# Altium schematic sheet 02 ECE453-Digital-Interface.SchDoc
size C; PageSetup: Record=PageOptions|CenterHorizontal=True|CenterVertical=True|PrintScale=0.70|XCorrection=1.00|YCorrection=1.00|PrintKind=1|BorderSize=5000000|LeftOffset=0|BottomOffset=0|Orientation=2|PaperLength=1000|PaperWidth=1000|Scale=100|PaperSource=7|PrintQuality=-3|MediaType=1|DitherType=10|PrintScaleMode=1|PaperKind=Tabloid|PaperIndex=3
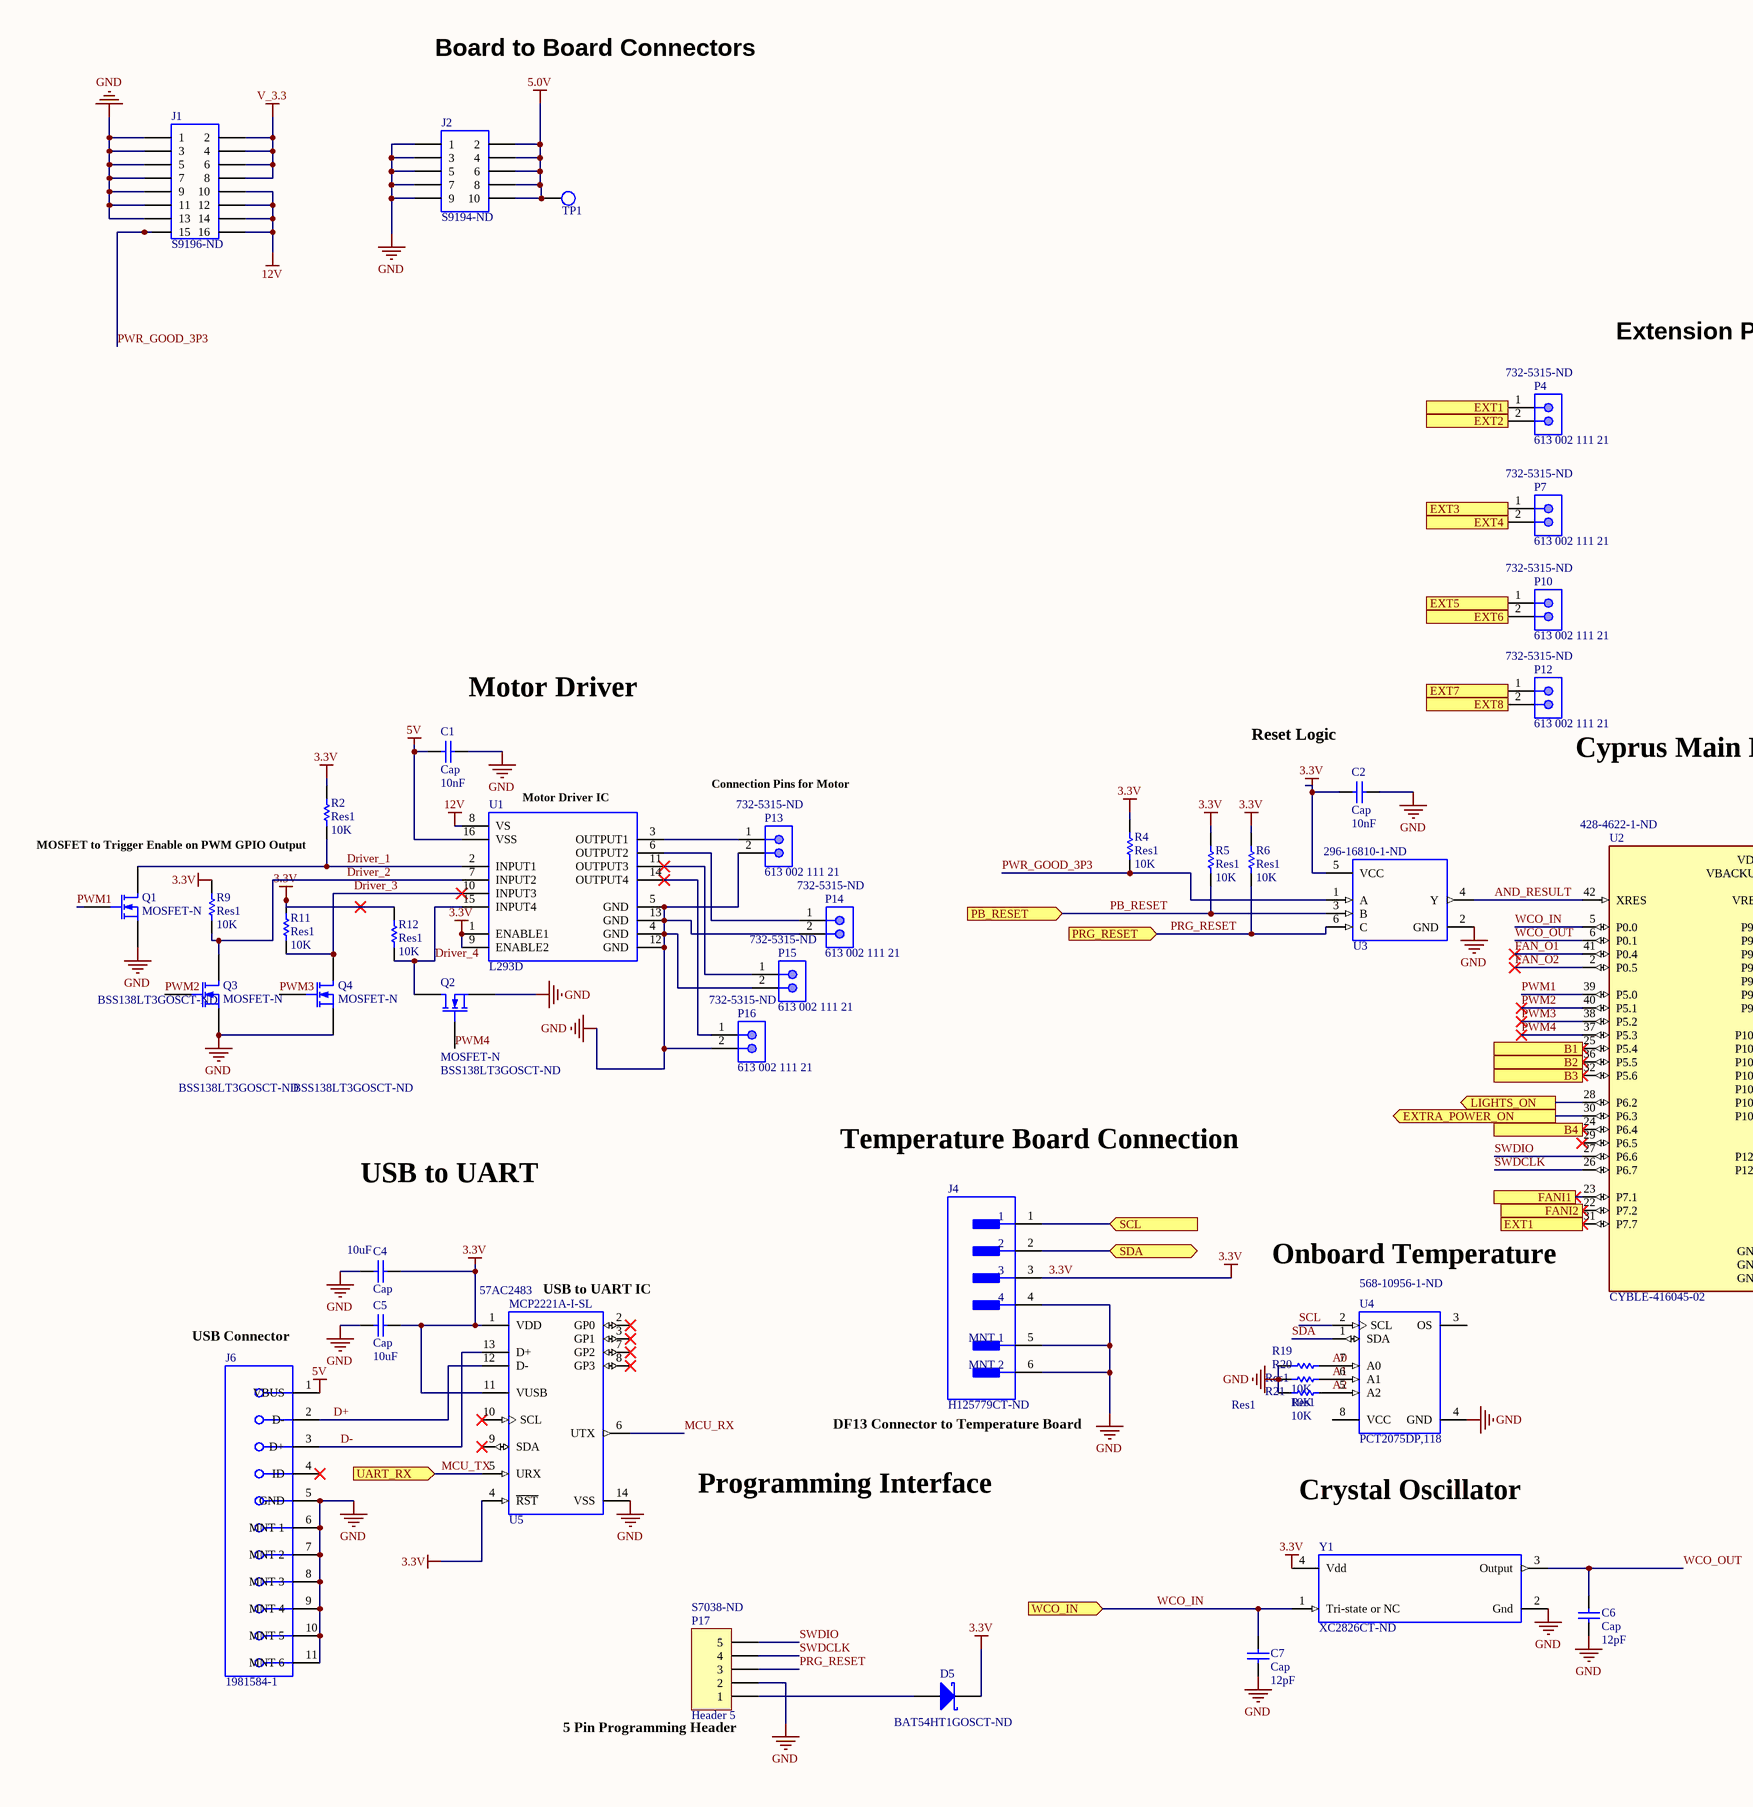
[diagram p0: 02 ECE453-Digital-Interface.SchDoc, left]
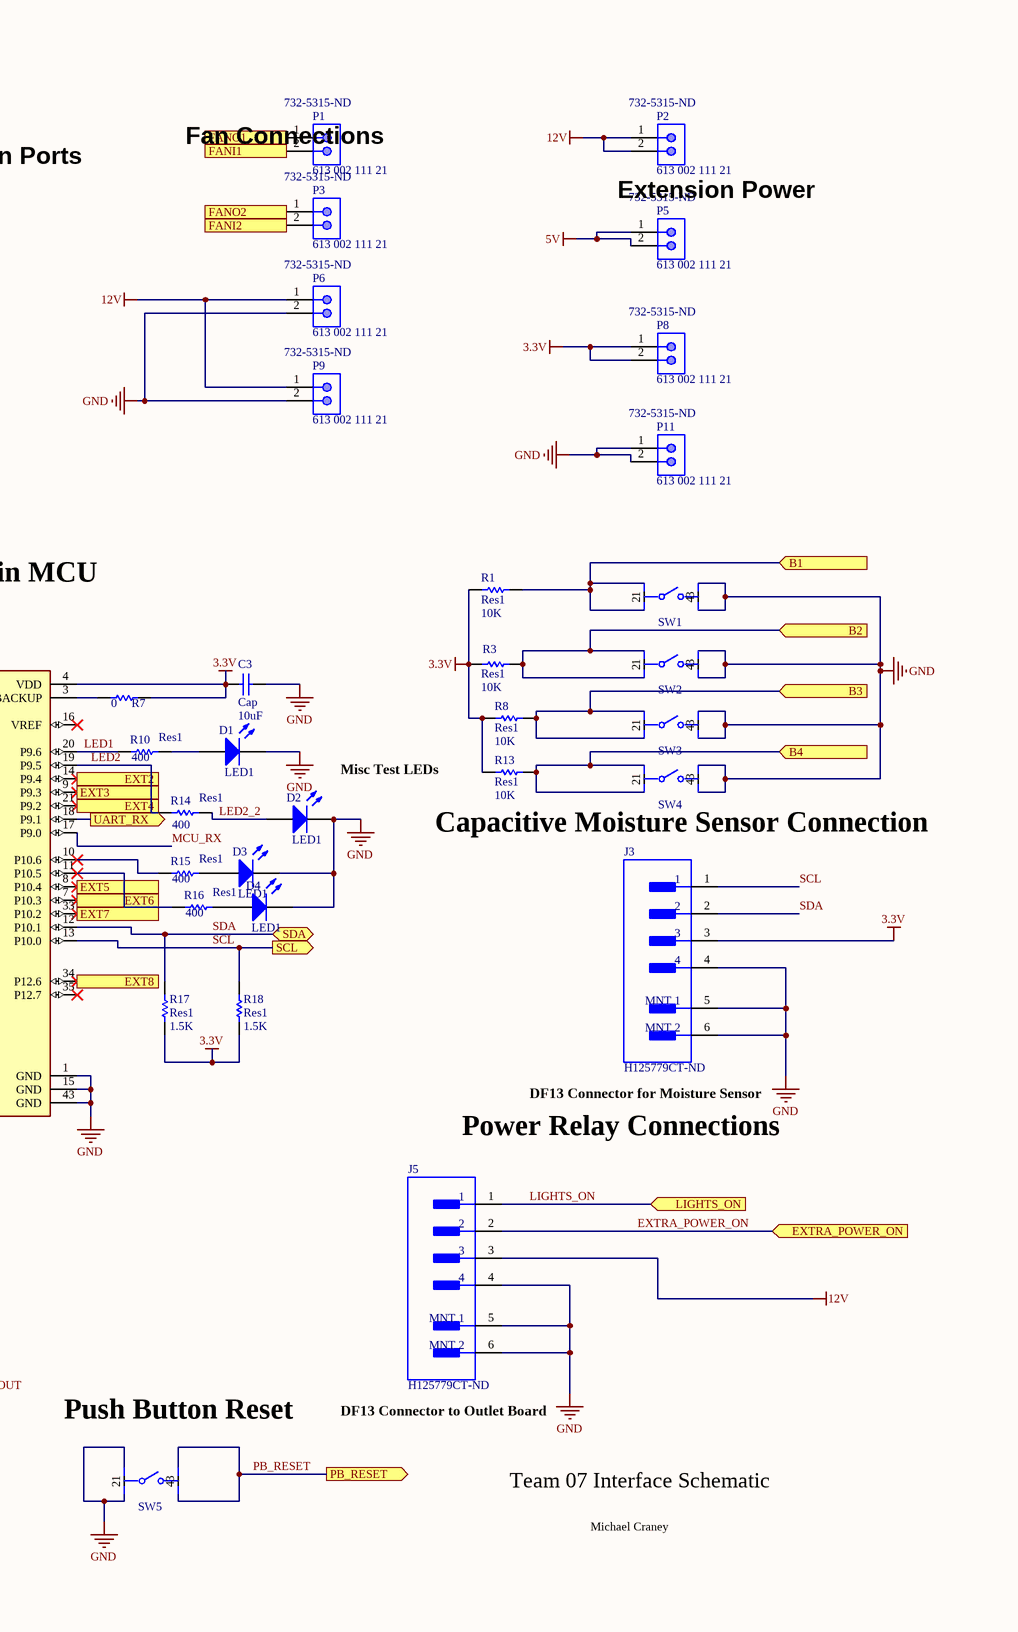
[diagram p1: 02 ECE453-Digital-Interface.SchDoc, right]

## Parts
C1  Cap  value 10nF  [Yageo_CC0805-0.85_IPC_B]
C2  Cap  value 10nF  [Yageo_CC0805-0.85_IPC_B]
C3  Cap  value 10uF  [Yageo_CC0805-0.85_IPC_B]
C4  Cap  value 10uF  [Yageo_CC0805-0.85_IPC_B]
C5  Cap  value 10uF  [Yageo_CC0805-0.85_IPC_B]
C6  Cap  value 12pF  [Yageo_CC0805-0.85_IPC_B]
C7  Cap  value 12pF  [Yageo_CC0805-0.85_IPC_B]
D1  LED1  [Dialight_598_0]
D2  LED1  [Dialight_598_0]
D3  LED1  [Dialight_598_0]
D4  LED1  [Dialight_598_0]
D5  Supplier Part Number 1: BAT54HT1GOSCT-ND  [On_Semiconductor_BAT54HT1G_0]
J1  Supplier Part Number 1: S9196-ND  [SFH11-PBPC-D08-ST-BK]  (hidden comment: SFH11-PBPC-D08-ST-BK)
J2  Supplier Part Number 1: S9194-ND  [SFH11-PBPC-D05-ST-BK]  (hidden comment: SFH11-PBPC-D05-ST-BK)
J3  Supplier Part Number 1: H125779CT-ND  [Hirose_0_MFG]  (hidden comment: DF13A-4P-1_25H_51)
J4  Supplier Part Number 1: H125779CT-ND  [Hirose_0_MFG]  (hidden comment: DF13A-4P-1_25H_51)
J5  Supplier Part Number 1: H125779CT-ND  [Hirose_0_MFG]  (hidden comment: DF13A-4P-1_25H_51)
J6  Part Number: 1981584-1  [TE_CONNECTIVITY_-_AMP_CONNECTORS_1981584-1_0]  (hidden comment: Conn_TE_CONNECTIVITY_-_AMP_CONNECTORS_1981584-1_eec)
P1  613 002 111 21  Supplier Part Number 1: 732-5315-ND  [WE-61300211121_V]
P2  613 002 111 21  Supplier Part Number 1: 732-5315-ND  [WE-61300211121_V]
P3  613 002 111 21  Supplier Part Number 1: 732-5315-ND  [WE-61300211121_V]
P4  613 002 111 21  Supplier Part Number 1: 732-5315-ND  [WE-61300211121_V]
P5  613 002 111 21  Supplier Part Number 1: 732-5315-ND  [WE-61300211121_V]
P6  613 002 111 21  Supplier Part Number 1: 732-5315-ND  [WE-61300211121_V]
P7  613 002 111 21  Supplier Part Number 1: 732-5315-ND  [WE-61300211121_V]
P8  613 002 111 21  Supplier Part Number 1: 732-5315-ND  [WE-61300211121_V]
P9  613 002 111 21  Supplier Part Number 1: 732-5315-ND  [WE-61300211121_V]
P10  613 002 111 21  Supplier Part Number 1: 732-5315-ND  [WE-61300211121_V]
P11  613 002 111 21  Supplier Part Number 1: 732-5315-ND  [WE-61300211121_V]
P12  613 002 111 21  Supplier Part Number 1: 732-5315-ND  [WE-61300211121_V]
P13  613 002 111 21  Supplier Part Number 1: 732-5315-ND  [WE-61300211121_V]
P14  613 002 111 21  Supplier Part Number 1: 732-5315-ND  [WE-61300211121_V]
P15  613 002 111 21  Supplier Part Number 1: 732-5315-ND  [WE-61300211121_V]
P16  613 002 111 21  Supplier Part Number 1: 732-5315-ND  [WE-61300211121_V]
P17  Header 5  Supplier Part Number 1: S7038-ND  [HDR1X5]
Q1  MOSFET-N  Supplier Part Number 1: BSS138LT3GOSCT-ND  [On_Semiconductor_318-08_IPC_B]
Q2  MOSFET-N  Supplier Part Number 1: BSS138LT3GOSCT-ND  [On_Semiconductor_318-08_IPC_B]
Q3  MOSFET-N  Supplier Part Number 1: BSS138LT3GOSCT-ND  [On_Semiconductor_318-08_IPC_B]
Q4  MOSFET-N  Supplier Part Number 1: BSS138LT3GOSCT-ND  [On_Semiconductor_318-08_IPC_B]
R1  Res1  value 10K  [RESC2013X70X40NL20T20]
R2  Res1  value 10K  [RESC2013X70X40NL20T20]
R3  Res1  value 10K  [RESC2013X70X40NL20T20]
R4  Res1  value 10K  [RESC2013X70X40NL20T20]
R5  Res1  value 10K  [RESC2013X70X40NL20T20]
R6  Res1  value 10K  [RESC2013X70X40NL20T20]
R7  0  [RESC2013X70X40NL20T20]
R8  Res1  value 10K  [RESC2013X70X40NL20T20]
R9  Res1  value 10K  [RESC2013X70X40NL20T20]
R10  Res1  value 400  [RESC2013X70X40NL20T20]
R11  Res1  value 10K  [RESC2013X70X40NL20T20]
R12  Res1  value 10K  [RESC2013X70X40NL20T20]
R13  Res1  value 10K  [RESC2013X70X40NL20T20]
R14  Res1  value 400  [RESC2013X70X40NL20T20]
R15  Res1  value 400  [RESC2013X70X40NL20T20]
R16  Res1  value 400  [RESC2013X70X40NL20T20]
R17  Res1  value 1.5K  [RESC2013X70X40NL20T20]
R18  Res1  value 1.5K  [RESC2013X70X40NL20T20]
R19  Res1  value 10K  [RESC2013X70X40NL20T20]
R20  Res1  value 10K  [RESC2013X70X40NL20T20]
R21  Res1  value 10K  [RESC2013X70X40NL20T20]
SW1  Switch_TE_FSM2JSMAATR_eec  [TE_FSM2JSMAATR_0]  (value not drawn)
SW2  Switch_TE_FSM2JSMAATR_eec  [TE_FSM2JSMAATR_0]  (value not drawn)
SW3  Switch_TE_FSM2JSMAATR_eec  [TE_FSM2JSMAATR_0]  (value not drawn)
SW4  Switch_TE_FSM2JSMAATR_eec  [TE_FSM2JSMAATR_0]  (value not drawn)
SW5  Switch_TE_FSM2JSMAATR_eec  [TE_FSM2JSMAATR_0]  (value not drawn)
TP1  TP_1206  [TP-SMC-1206]  (value not drawn)
U1  Part Number: L293D  [STMicroelectronics_L293D_0]  (hidden comment: IC_STMicroelectronics_L293D_eec)
U2  CYBLE-416045-02  Supplier Part Number 1: 428-4622-1-ND  [Cypress_Semiconductor_0_MFG]
U3  Supplier Part Number 1: 296-16810-1-ND  [Texas_Instruments_DBV0006A_0]  (hidden comment: SN74LVC1G11DBVR)
U4  PCT2075DP,118  Supplier Part Number 1: 568-10956-1-ND  [NXP-SOT505-1_N]
U5  MCP2221A-I-SL  Supplier Part Number 1: 57AC2483  [Microchip_C04-065-SL_IPC_B - duplicate]
Y1  Supplier Part Number 1: XC2826CT-ND  [ECS_327ATQMV_MFG]  (hidden comment: ECS-327ATQMV-AS-TR)

## Ports
B1 (in), B2 (in), B3 (in), B4 (in), EXT1, EXT2, EXT3, EXT4, EXT5, EXT6, EXT7, EXT8, EXTRA_POWER_ON (in), EXTRA_POWER_ON (out), FANI1, FANI2, FANO1, FANO2, LIGHTS_ON (in), LIGHTS_ON (out), PB_RESET (in), PB_RESET (out), PRG_RESET (in), SCL (in), SCL (out), SDA (bidir), UART_RX (in), UART_RX (out), WCO_IN (in)

## Nets
3.3V: C2.2 C3.2 C4.1 C5.1 D5.2(K) J3.3 J4.3 P8.1 P8.2 R1.2 R2.2 R3.2 R4.2 R5.2 R6.2 R7.1 R8.2 R9.1 R11.1 R12.1 R13.2 R17.1 R18.1 U1.1(ENABLE1) U1.9(ENABLE2) U2.4(VDD) U3.5(VCC) U5.1(VDD) U5.4(~{RST}) U5.11(VUSB) Y1.4(Vdd)
5.0V: J2.2 J2.4 J2.6 J2.8 J2.10 TP1.1
5V: C1.2 J6.1(VBUS) P5.1 P5.2 U1.16(VSS)
12V: J1.10 J1.12 J1.14 J1.16 J5.3 P2.1 P2.2 P6.1 P9.1 U1.8(VS)
GND: C1.1 C2.1 C3.1 C4.2 C5.2 C6.1 C7.1 D1.2(K) D2.2(K) D3.2(K) D4.2(K) J1.1 J1.3 J1.5 J1.7 J1.9 J1.11 J1.13 J2.1 J2.3 J2.5 J2.7 J2.9 J3.4 J3.5(MNT_1) J3.6(MNT_2) J4.4 J4.5(MNT_1) J4.6(MNT_2) J5.4 J5.5(MNT_1) J5.6(MNT_2) J6.5(GND) J6.6(MNT_1) J6.7(MNT_2) J6.8(MNT_3) J6.9(MNT_4) J6.10(MNT_5) J6.11(MNT_6) P6.2 P9.2 P11.1 P11.2 P13.2 P14.2 P15.2 P16.2 P17.2 Q1.3(S) Q2.3(S) Q3.3(S) Q4.3(S) R19.2 R20.2 R21.2 SW1.3 SW1.4 SW2.3 SW2.4 SW3.3 SW3.4 SW4.3 SW4.4 SW5.1 SW5.2 U1.4(GND) U1.5(GND) U1.12(GND) U1.13(GND) U2.1(GND) U2.15(GND) U2.43(GND) U3.2(GND) U4.4(GND) U5.14(VSS) Y1.2(Gnd)
V_3.3: J1.2 J1.4 J1.6 J1.8
A0: R19.1 U4.7(A0)
A1: R20.1 U4.6(A1)
A2: R21.1 U4.5(A2)
AND_RESULT: U2.42(XRES) U3.4(Y)
B1: R1.1 SW1.1 SW1.2 U2.25(P5.4) ; port B1
B2: R3.1 SW2.1 SW2.2 U2.36(P5.5) ; port B2
B3: R8.1 SW3.1 SW3.2 U2.32(P5.6) ; port B3
B4: R13.1 SW4.1 SW4.2 U2.24(P6.4) ; port B4
D+: J6.2(D-) U5.12(D-)
D-: J6.3(D+) U5.13(D+)
Driver_1: Q1.1(D) R2.1 U1.2(INPUT1)
Driver_2: Q3.1(D) R9.2 U1.7(INPUT2)
Driver_3: Q4.1(D) R11.2 U1.10(INPUT3)
Driver_4: Q2.1(D) R12.2 U1.15(INPUT4)
EXT1: P4.1 U2.31(P7.7) ; port EXT1
EXT2: P4.2 U2.14(P9.4) ; port EXT2
EXT3: P7.1 U2.9(P9.3) ; port EXT3
EXT4: P7.2 U2.21(P9.2) ; port EXT4
EXT5: P10.1 U2.8(P10.4) ; port EXT5
EXT6: P10.2 U2.7(P10.3) ; port EXT6
EXT7: P12.1 U2.33(P10.2) ; port EXT7
EXT8: P12.2 U2.34(P12.6) ; port EXT8
EXTRA_POWER_ON: J5.2 U2.30(P6.3) ; port EXTRA_POWER_ON
FAN_O1: U2.41(P0.4)
FAN_O2: U2.2(P0.5)
FANI1: P1.2 U2.23(P7.1) ; port FANI1
FANI2: P3.2 U2.22(P7.2) ; port FANI2
FANO1: P1.1 ; port FANO1
FANO2: P3.1 ; port FANO2
LED1: R10.1 U2.20(P9.6)
LED2: R14.1 U2.19(P9.5)
LED2_2: D2.1(A) R14.2
LIGHTS_ON: J5.1 U2.28(P6.2) ; port LIGHTS_ON
MCU_RX: U2.17(P9.0) U5.6(UTX)
MCU_TX: U2.18(P9.1) U5.5(URX) ; port UART_RX
PB_RESET: R5.1 SW5.3 SW5.4 U3.3(B) ; port PB_RESET
PRG_RESET: P17.3 R6.1 U3.6(C) ; port PRG_RESET
PWM1: Q1.2(G) U2.39(P5.0)
PWM2: Q3.2(G) U2.40(P5.1)
PWM3: Q4.2(G) U2.38(P5.2)
PWM4: Q2.2(G) U2.37(P5.3)
PWR_GOOD_3P3: J1.15 R4.1 U3.1(A)
SCL: J3.1 J4.1 R18.2 U2.13(P10.0) U4.2(SCL) ; port SCL
SDA: J3.2 J4.2 R17.2 U2.12(P10.1) U4.1(SDA) ; port SDA
SWDCLK: P17.4 U2.26(P6.7)
SWDIO: P17.5 U2.27(P6.6)
WCO_IN: C7.2 U2.5(P0.0) Y1.1(Tri-state_or_NC) ; port WCO_IN
WCO_OUT: C6.2 U2.6(P0.1) Y1.3(Output)
NetD1_1: D1.1(A) R10.2
NetD3_1: D3.1(A) R15.2
NetD4_1: D4.1(A) R16.2
NetD5_1: D5.1(A) P17.1
NetP13_1: P13.1 U1.3(OUTPUT1)
NetP14_1: P14.1 U1.6(OUTPUT2)
NetP15_1: P15.1 U1.11(OUTPUT3)
NetP16_1: P16.1 U1.14(OUTPUT4)
NetR7_2: R7.2 U2.3(VBACKUP)
NetR15_1: R15.1 U2.10(P10.6)
NetR16_1: R16.1 U2.11(P10.5)

Not connected (* = marked no-connect by the designer): J6 4(ID)*; U2 16(VREF)* 29(P6.5)* 35(P12.7)*; U4 3(OS) 8(VCC); U5 2(GP0)* 3(GP1)* 7(GP2)* 8(GP3)* 9(SDA)* 10(SCL)*

## Notes on the sheet
- Board to Board Connectors
- Extension Ports
- Fan Connections
- Extension Power
- (near C1) Motor Driver
- (near P13) Connection Pins for Motor
- (near C2) Reset Logic
- (near P12) Cyprus Main MCU
- MOSFET to Trigger Enable on PWM GPIO Output
- (near U1) Motor Driver IC
- Misc Test LEDs
- (near SW4) Capacitive Moisture Sensor Connection
- USB to UART
- Temperature Board Connection
- (near U5) USB to UART IC
- Onboard Temperature
- Power Relay Connections
- (near J3) DF13 Connector for Moisture Sensor
- (near J6) USB Connector
- (near J4) DF13 Connector to Temperature Board
- Programming Interface
- Crystal Oscillator
- (near SW5) Push Button Reset
- (near J5) DF13 Connector to Outlet Board
- Team 07 Interface Schematic
- (near P17) 5 Pin Programming Header
- Michael Craney

## Library data of the parts
C1-C7 = Cap: Capacitor; Published: 8-Jun-2000; LatestRevisionDate: 17-Jul-2002; LatestRevisionNote: Re-released for DXP Platform.; PackageReference: RAD-0.3; Publisher: Altium Limited; PackageDescription: Radial Cap, Thru-Hole; 2 Leads; 0.3 in Pin Spacing; Supplier 1: Digi-Key
  C1 C2: Supplier Part Number 1: 311-1136-1-ND
  C3-C5: Supplier Part Number 1: 311-1355-1-ND
  C6 C7: Supplier Part Number 1: 311-1100-1-ND
D1-D4 = LED1: Typical RED GaAs LED; Published: 8-Jun-2000; LatestRevisionDate: 08-Jul-2005; LatestRevisionNote: Mech Layer 1 removed.; PackageReference: LED-1; Publisher: Altium Limited; PackageDescription: LED; 2 Leads; Supplier 1: Digi-Key; Supplier Part Number 1: 350-2038-1-ND
D5 = D Schottky: Schottky Diode; Published: 8-Jun-2000; LatestRevisionDate: 17-Jul-2002; LatestRevisionNote: Re-released for DXP Platform.; PackageReference: SMB; Publisher: Altium Limited; PackageDescription: DO-214-AA/SMB; 2 C-Bend Leads; Body 5.3 x 3.6 mm, inc. leads (LxW); Code_JEDEC: DO-214-AA; Supplier 1: Digi-Key
J1 = SFH11-PBPC-D08-ST-BK: CONN HDR 10POS 0.1 GOLD PCB; Manufacturer 1: Sullins; Number of Positions: 16; Connector Type: Header,Socket; Pitch: 0.1inch; ComponentLink1URL: https://datasheet.ciiva.com/754/sfh11-pxxc-dxx-st-xx11160-c-754555.pdf?src-supplier=Digi-Key; ComponentLink1Description: https://datasheet.ciiva.com/754/sfh11-pxxc-dxx-st-xx11160-c-754555.pdf?src-supplier=Digi-Key; Supplier 1: Digi-Key; Manufacturer Part Number 1: SFH11-PBPC-D08-ST-BK; Stock 1: 0; Pricing 1: 1=1.04000, 10=0.91600, 100=0.79000, 500=0.64638, 1000=0.57456, 5000=0.51870 (USD); RoHS: Yes; Mount: Through Hole; Color: Black; Contact Plating: Gold; Package Quantity: 1; Number of Rows: 2; Packaging: Tray; Termination: Solder; Row Spacing: 0.1inch; Lead Free: Lead Free; ComponentLink2URL: https://datasheet.ciiva.com/754/sfh11-pxxc-dxx-st-xx11160-c-754557.pdf?src-supplier=Digi-Key; ComponentLink2Description: https://datasheet.ciiva.com/754/sfh11-pxxc-dxx-st-xx11160-c-754557.pdf?src-supplier=Digi-Key
J2 = SFH11-PBPC-D05-ST-BK: CONN HDR 10POS 0.1 GOLD PCB; Manufacturer 1: Sullins; Number of Positions: 10; Connector Type: Header; Pitch: 0.1inch; Supplier 1: Digi-Key; Manufacturer Part Number 1: SFH11-PBPC-D05-ST-BK; Stock 1: 26289; Pricing 1: 1=0.66000, 10=0.57600, 100=0.49700, 500=0.40662, 1000=0.36144, 5000=0.32630 (USD); RoHS: Yes; Mount: Through Hole; Color: Black; Contact Plating: Gold; Package Quantity: 1; Number of Rows: 2; Packaging: Tray; Termination: Solder; Row Spacing: 0.1inch; Lead Free: Lead Free; ComponentLink1URL: https://datasheet.ciiva.com/754/sfh11-pxxc-dxx-st-xx11160-c-754555.pdf?src-supplier=Digi-Key; ComponentLink1Description: https://datasheet.ciiva.com/754/sfh11-pxxc-dxx-st-xx11160-c-754555.pdf?src-supplier=Digi-Key
J3-J5 = DF13A-4P-1_25H_51: 4 pin df13; Supplier 1: Digi-Key
J6 = Conn_TE_CONNECTIVITY_-_AMP_CONNECTORS_1981584-1_eec: Micro USB2.0; Manufacturer: TE CONNECTIVITY - AMP CONNECTORS; Voltage: 30V; Is Female: yes; helpURL: https://upverter.com/upn/revision/dedb0eacb1b6d15a/; ComponentLink2Description: Datasheet; Temperature: to; Package: CONN_USB_SMT; Supplier 2: Mouser; Price: 1.40015774577; Supplier 1: Digi-Key; ComponentLink1URL: https://upverter.com/upn/revision/dedb0eacb1b6d15a/; Supplier Part Number 1: A97799CT-ND; ComponentLink1Description: Upverter; ComponentLink2URL: http://www.te.com/commerce/DocumentDelivery/DDEController?Action=srchrtrv&DocNm=1981584&DocType=Customer+Drawing&DocLang=English; RoHS: UNKNOWN; Mouser Part Number: 571-1981584-1; Operating Temperature Low: -30°C; Digikey Part Number:: A97799CT-ND; Operating Temperature High: 85°C
P1-P16 = 61300211121: Male Header, Pitch 2.54 mm, 1 x 2 Position, Height 8.54 mm, Tail Length 3 mm, -40 to 105 degC, RoHS, Bulk; ComponentLink1Description: Manufacturer URL; ComponentLink2Description: Datasheet; DatasheetVersion: Rev. J; ComponentLink1URL: https://www.we-online.com/; ComponentLink2URL: http://katalog.we-online.de/em/datasheet/6130xx11121.pdf; Mounting Technology: Through Hole; PackageDescription: Male Header, Pitch 2.54 mm, 1 x 2 Position, Height 8.54 mm, Tail Length 3 mm; PartNumber: 613 002 111 21; Supplier 1: Digi-Key
P17 = Header 5: CONN HDR 5POS 0.1 GOLD PCB; Manufacturer: Sullins; Manufacturer Part Number: PPPC051LFBN-RC; Number of Positions: 5; Pitch: 0.1inch; LatestRevisionDate: 17-Jul-2002; LatestRevisionNote: Re-released for DXP Platform.; Publisher: Altium Limited; Supplier 1: Digi-Key; RoHS: Yes; Category: Connectors; Stock 1: 10661; Pricing 1: 1=0.49000, 10=0.45900, 100=0.35190, 500=0.30600, 1000=0.25245, 5000=0.22185, 10000=0.22100 (USD); Mount: Through Hole; Color: Black; Contact Plating: Gold; Contact Material: Bronze; Housing Material: Plastic; Package Quantity: 1000; Number of Rows: 1; Packaging: Bulk; Termination: Solder; Connector Type: Header; Contact Type: Female Socket; Length: 13.2mm; Width: 2.5mm; Height: 8.5mm; Lead Free: Lead Free; RoHS Compliant: Yes; ComponentLink1URL: https://media.digikey.com/pdf/Data%20Sheets/Sullins%20PDFs/Female_Headers.100_DS.pdf?src-supplier=Digi-Key; ComponentLink1Description: https://media.digikey.com/pdf/Data%20Sheets/Sullins%20PDFs/Female_Headers.100_DS.pdf?src-supplier=Digi-Key; ComponentLink2URL: http://www.sullinscorp.com/catalogs/78_Page80-81_HEADER_.100_2.54mm_FEMALE.pdf?src-supplier=Future+Electronics; ComponentLink2Description: http://www.sullinscorp.com/catalogs/78_Page80-81_HEADER_.100_2.54mm_FEMALE.pdf?src-supplier=Future+Electronics
Q1-Q4 = MOSFET-N: N-Channel MOSFET; Published: 8-Jun-2000; LatestRevisionDate: 17-Jul-2002; LatestRevisionNote: Re-released for DXP Platform.; PackageVersion: 1995/1996; PackageReference: E3; Publisher: Altium Limited; PackageDescription: TO, Flat Index; 3 In-Line, Axial Leads; Body Dia. 4.6mm; Lead Dia. 0.5 mm (max); Supplier 1: Digi-Key
R1-R21 = Res1: Resistor; Published: 8-Jun-2000; LatestRevisionDate: 17-Jul-2002; LatestRevisionNote: Re-released for DXP Platform.; PackageReference: AXIAL-0.3; Publisher: Altium Limited; PackageDescription: Axial Device, Thru-Hole; 2 Leads; 0.3 in Pin Spacing; Supplier 1: Digi-Key
  R1-R6 R8 R9 R11-R13 R19-R21: Supplier Part Number 1: P10.0KCCT-ND
  R7: Supplier Part Number 1: P0.0ACT-ND
  R10 R14-R16: Supplier Part Number 1: 541-430CCT-ND
  R17 R18: Supplier Part Number 1: 2019-RK73B2ATTD152JCT-ND
SW1-SW5 = Switch_TE_FSM2JSMAATR_eec: SWITCH TACTILE SPST-NO 0.05A 24V; Manufacturer: TE; Part Number: FSM2JSMAATR; helpURL: https://upverter.com/upn/revision/e87fdb98fc0d886d/; ComponentLink2Description: Datasheet; Temperature: -35°C to +85°C; Package: SW_SMT_TACT; Supplier 2: Mouser; Supplier 1: Digi-Key; ComponentLink1URL: https://upverter.com/upn/revision/e87fdb98fc0d886d/; Supplier Part Number 2: 506-FSM2JSMAATR; Supplier Part Number 1: 450-1792-1-ND; ComponentLink1Description: Upverter; ComponentLink2URL: http://www.te.com/commerce/DocumentDelivery/DDEController?Action=srchrtrv&DocNm=2-1437565-7&DocType=Customer+Drawing&DocLang=English; RoHS: TRUE; Mouser Part Number: 506-FSM2JSMAATR; Digikey Description: SWITCH TACTILE SPST-NO 0.05A 24V; Digikey Part Number: 450-1792-1-ND; Lead Free: yes; Temperature Range Low: -35°C; Temperature Range High: +85°C
TP1 = TP_1206: Test Point SMD 1206; Supplier 1: Digi-Key; Supplier Part Number 1: A106143CT-ND
U1 = IC_STMicroelectronics_L293D_eec: 4-Channel Motor Driver 24V 16-Pin Power DIP Tube; Category 9E07530Daf1645C0: Semiconductors and Actives; Category 45Fa88F0772B9E3D: Half Bridges; Category 20B3Edb914A9Fb74: Uncategorized; Category 2Fc5E2Cf1B85F402: Interface ICs; Category 56439B4967F48D84: Power Management; Category D2Bc1Fb6E06F097B: Solid State Switches; Symbol 0 0: Standard; Num Pins: 16; Max Supply Voltage: 36V; Min Supply Voltage: 4.5V; Number of Outputs: 4; Output Current: 600mA; Max Output Current: 1.2A; Motor Type: Brushed; Operating Supply Current: 2mA; Power Dissipation: 4W; helpURL: https://upverter.com/upn/revision/e6134e389598ca22/; ComponentLink2Description: Datasheet; Temperature: -40°C to +150°C; Package: Powerdip (12+2+2); Supplier 2: Mouser; Price: 2.80087938713; Supplier 1: Digi-Key; ComponentLink1URL: https://upverter.com/upn/revision/e6134e389598ca22/; Supplier Part Number 2: 511-L293D; Supplier Part Number 1: 497-2936-5-ND; Manufacturer: STMicroelectronics; ComponentLink1Description: Upverter; ComponentLink2URL: https://upverter.com/datasheet/69b4bfb6eef435fc169310577e03cbf66990c4fa.pdf; RoHS: TRUE; Mouser Part Number: 511-L293D; Ipc Land Pattern Name: DIP880W50P254L2000H510Q16; Category 84F649Fcb0Ed5F31: Uncategorized; Octopart Part Number: 81d548d881985e12; Temperature Range High: +150°C; Digikey Description: IC Bipolar Motor Driver Parallel 16-PowerDIP; Digikey Part Number: 497-2936-5-ND; Type: integrated circuit; Lead Free: yes; Temperature Range Low: -40°C; Mounting Type: Through Hole; Manufacturer Part Number: L293D; Category: Motor Drivers; Stock 1: 710; Pricing 1: 1=4.15000, 10=3.72300, 25=3.52000, 100=2.95180 (USD); Mount: Through Hole; Case/Package: DIP; Number of Pins: 16; Min Operating Temperature: -40°C; Max Operating Temperature: 150°C; Package Quantity: 25; Packaging: Rail/Tube; Operating Supply Voltage: 24V; Series: -; Output Current per Channel: 600mA; Number of Channels: 4; Max Collector Current: 600mA; Collector Emitter Voltage (VCEO): 36V; Length: 20mm; Width: 7.1mm; Height: 5.1mm; Radiation Hardening: No; RoHS Compliant: Yes; ComponentLink3URL: https://datasheet.ciiva.com/15109/getdatasheetpartid-121660-15109379.pdf?src-supplier=Verical; ComponentLink3Description: https://datasheet.ciiva.com/15109/getdatasheetpartid-121660-15109379.pdf?src-supplier=Verical; ComponentLink4URL: https://datasheet.ciiva.com/14150/ocl293d-647107-dat-en-14150297.pdf?src-supplier=Distrelec; ComponentLink4Description: https://datasheet.ciiva.com/14150/ocl293d-647107-dat-en-14150297.pdf?src-supplier=Distrelec; ComponentLink5URL: https://datasheet.ciiva.com/26347/82-0192-26347871.pdf?src-supplier=Rapid+Electronics; ComponentLink5Description: https://datasheet.ciiva.com/26347/82-0192-26347871.pdf?src-supplier=Rapid+Electronics; ComponentLink6URL: https://datasheet.ciiva.com/29307/156134-da-01-en-4-kanal-treiber-ic-l293d-stm-29307000.pdf?src-supplier=Conrad; ComponentLink6Description: https://datasheet.ciiva.com/29307/156134-da-01-en-4-kanal-treiber-ic-l293d-stm-29307000.pdf?src-supplier=Conrad; ComponentLink7URL: https://datasheet.ciiva.com/1955/cd00000059-1955400.pdf?src-supplier=Digi-Key; ComponentLink7Description: https://datasheet.ciiva.com/1955/cd00000059-1955400.pdf?src-supplier=Digi-Key; ComponentLink8URL: https://datasheet.ciiva.com/4895/cd00000059-4895945.pdf?src-supplier=Mouser; ComponentLink8Description: https://datasheet.ciiva.com/4895/cd00000059-4895945.pdf?src-supplier=Mouser; ComponentLink9URL: https://datasheet.ciiva.com/16458/cd00000059-16458220.pdf?src-supplier=Future+Electronics; ComponentLink9Description: https://datasheet.ciiva.com/16458/cd00000059-16458220.pdf?src-supplier=Future+Electronics
U2 = CYBLE-416045-02: CONN HDR 5POS 0.1 GOLD PCB; Manufacturer: Sullins; Manufacturer Part Number: PPPC051LFBN-RC; MF: {'manufacturer': u'Cypress Semiconductor'}; Number of Positions: 5; Connector Type: Header; Pitch: 0.1inch; Value: *; Package: None; MP: CYBLE-416045-02; Price: None; Availability: Unavailable; RoHS: Yes; Category: Connectors; Stock 1: 10661; Pricing 1: 1=0.49000, 10=0.45900, 100=0.35190, 500=0.30600, 1000=0.25245, 5000=0.22185, 10000=0.22100 (USD); Mount: Through Hole; Color: Black; Contact Plating: Gold; Contact Material: Bronze; Housing Material: Plastic; Package Quantity: 1000; Number of Rows: 1; Packaging: Bulk; Termination: Solder; Contact Type: Female Socket; Length: 13.2mm; Width: 2.5mm; Height: 8.5mm; Lead Free: Lead Free; RoHS Compliant: Yes; ComponentLink1URL: https://media.digikey.com/pdf/Data%20Sheets/Sullins%20PDFs/Female_Headers.100_DS.pdf?src-supplier=Digi-Key; ComponentLink1Description: https://media.digikey.com/pdf/Data%20Sheets/Sullins%20PDFs/Female_Headers.100_DS.pdf?src-supplier=Digi-Key; ComponentLink2URL: http://www.sullinscorp.com/catalogs/78_Page80-81_HEADER_.100_2.54mm_FEMALE.pdf?src-supplier=Future+Electronics; ComponentLink2Description: http://www.sullinscorp.com/catalogs/78_Page80-81_HEADER_.100_2.54mm_FEMALE.pdf?src-supplier=Future+Electronics; Supplier 1: Digi-Key
U3 = SN74LVC1G11DBVR: 3 to 1 AND Gate; Supplier 1: Digi-Key
U4 = PCT2075DP,118: I2C-Bus Fm+, 1 Degree C Accuracy, Digital Temperature Sensor and Thermal Watchdog, 2.7 to 5.5 V Supply, -55 to 125 degC, 8-Pin SOT505-1, RoHS, Reel; Manufacturer: NXP Semiconductors; Accuracy on-chip (degC): 1@-25 to 100 / 2@-55 to 125; SMBus clock (kHz): 1000; Assignable addresses: 27; ComponentLink1Description: Manufacturer URL; Operating Voltage (VDC): 2.7 to 5.5; ComponentLink2Description: Datasheet; PartNumber: PCT2075DP,118; ComponentLink3Description: Package Specification; PackageReference: SOT505-1; ComponentLink3URL: http://www.nxp.com/documents/outline_drawing/sot505-1_po.pdf; DatasheetVersion: Rev. 7; ComponentLink1URL: http://www.nxp.com/; ComponentLink2URL: http://www.nxp.com/documents/data_sheet/PCT2075.pdf; Packing: Reel; Mounting Technology: Surface Mount; PackageDescription: 8-Pin Plastic Thin Shrink Small Outline Package, Body 3 x 3 mm, Pitch 0.65 mm; PackageVersion: 03-02-18, 02/2003; Supplier 1: Digi-Key
U5 = MCP2221A-I-SL: USB to UART; Supplier 1: Newark
Y1 = ECS-327ATQMV-AS-TR: crystal oscillator; Supplier 1: Digi-Key